# EAGLE design ESP8266-Programmer_2015-11-16 (EAGLE 7.4.0)
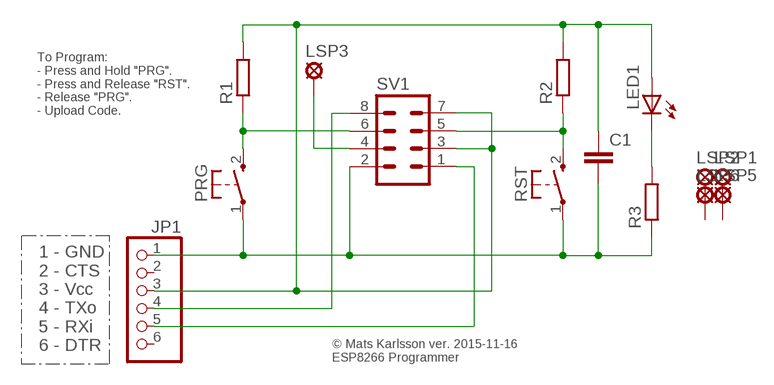
[diagram p0: schematic, sheet 1]

## Parts
C1  C-EU025_050-035X075  [C025_050-035X075]
JP1  PINHD-1X6  [1X06]
LED1  TLLG4400  [LED3MM]
LSP1  SE11  [SE11]
LSP2  SE11  [SE11]
LSP3  SE11  [SE11]
LSP5  SE11  [SE11]
LSP6  SE11  [SE11]
PRG  KSS-2EG4430  [KSS-2EG4430]
R1  R-EU_0204/5  [0204/5]
R2  R-EU_0204/5  [0204/5]
R3  R-EU_0204/7  [0204/7]
RST  KSS-2EG4430  [KSS-2EG4430]
SV1  MA04-2  [MA04-2]

## Nets
N$1: C1.2 JP1.1 PRG.1(P) R3.1 RST.1(P) SV1.2
N$2: R2.1 RST.2(S) SV1.5
N$3: LSP3.MP SV1.4
N$4: JP1.4 SV1.8
N$5: PRG.2(S) R1.1 SV1.6
N$7: C1.1 JP1.3 LED1.A R1.2 R2.2 SV1.3 SV1.7
N$8: JP1.5 SV1.1
N$9: LED1.K(C) R3.2
Unconnected: JP1.2 JP1.6 LSP1.MP LSP2.MP LSP5.MP LSP6.MP

## Notes on the sheet
- To Program:
  - Press and Hold "PRG".
  - Press and Release "RST".
  - Release "PRG".
  - Upload Code.
- 1 - GND
  2 - CTS
  3 - Vcc
  4 - TXo
  5 - RXi
  6 - DTR
- © Mats Karlsson ver. 2015-11-16
  ESP8266 Programmer

## Library data of the parts
C1 = rcl:C-EU: CAPACITOR, European symbol
JP1 = pinhead:PINHD-1X6: PIN HEADER
LED1 = led:TLLG4400: Low Current (2mA) LED 3 mm Tinted Diffused Package color GREEN Source: Data sheet <http://www.farnell.com/datasheets/391098.pdf>; MF: VISHAY SEMICONDUCTOR; OC_FARNELL: 1612435
LSP1-LSP3 LSP5 LSP6 = solpad:SE11: SOLDER PAD RTM, drill 1,1mm, distributor Buerklin, 07F810
PRG RST = buttons:KSS-2EG4430: Size: 3x6mm Height: 5mm from PCB Rating: DC12v 50mA Travel: 0.25±0.10mm Operating Force: 180±50gf Return Force: 60gf min Contact resistance: 100m? max Insulation resistance: 100M? min Operating life?50,000 cycles
R1-R3 = rcl:R-EU_: RESISTOR, European symbol
SV1 = con-lstb:MA04-2: PIN HEADER; OC_FARNELL: unknown; OC_NEWARK: unknown

## Board
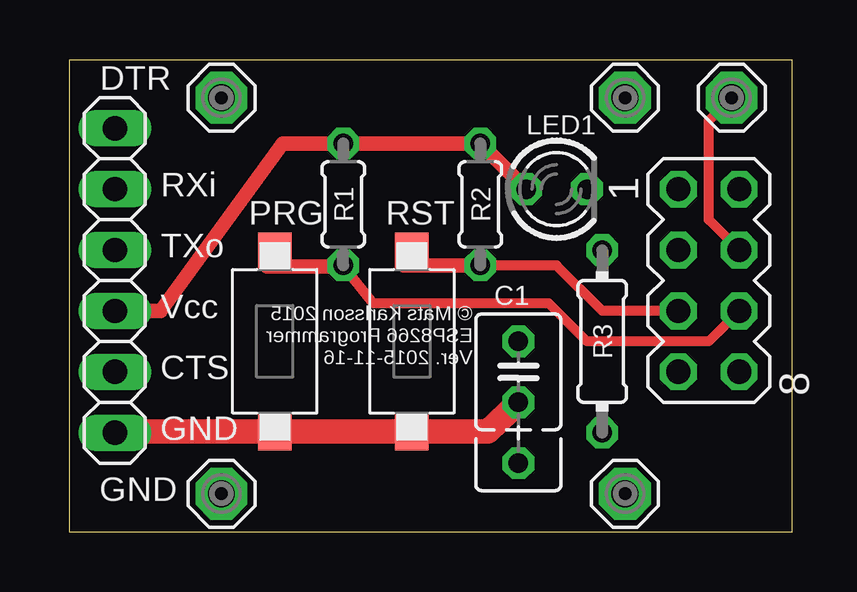
[diagram p1: board, top side]
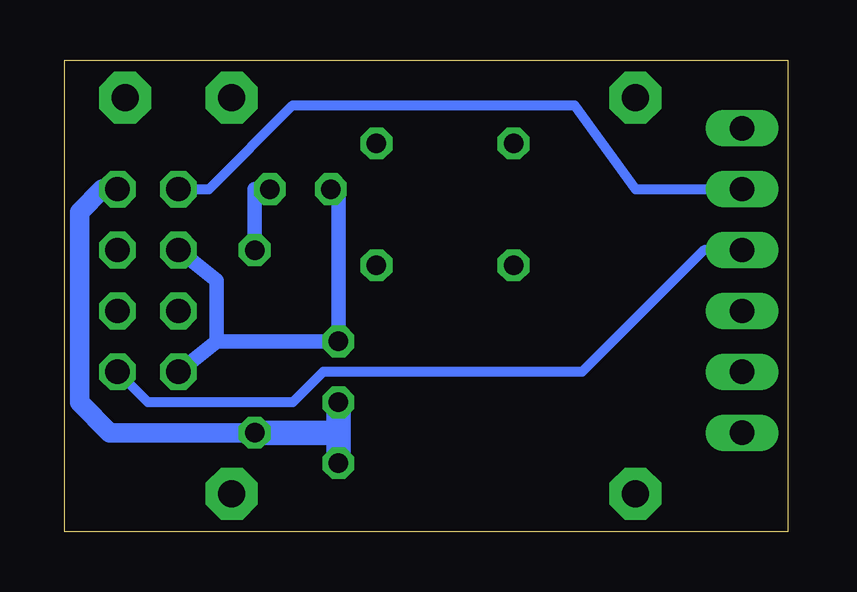
[diagram p2: board, bottom side, seen from below]

Size 30.15 x 19.68 mm. Coordinates in mm from the lower left corner, seen from the top.
Outline: 0,0 30.15,0 30.15,19.68 0,19.68 0,0
Copper layers (1*16): Top 0.035mm / dielectric 1.5mm / Bottom 0.035mm
Design rules "default": minimum track width 10mil, minimum drill 24mil, track to track 8mil, track to pad 8mil, pad to pad 8mil, via to via 8mil, smd to smd 8mil, copper to edge 40mil, drill to drill 8mil, minimum pad ring 10mil, minimum via ring 8mil, stop-mask expansion 4mil, vias tented up to drill 0mil, thermal gap 10mil

### Footprints (pad centres in the part's own frame; a part is rotated, then mirrored left to right if it is on the bottom)
C025_050-035X075 = drill 0.813 octagon: 1 -1.27,0; 2 1.27,0; 3 3.81,0
1X06 = drill 1.016 long: 1 -6.35,0; 2 -3.81,0; 3 -1.27,0; 4 1.27,0; 5 3.81,0; 6 6.35,0
LED3MM = drill 0.813 octagon: A -1.27,0; K 1.27,0
SE11 = drill 1.118 pad 2.159 octagon: MP 0,0
KSS-2EG4430 = smd 1.6 x 1.4: 1 -3.75,0; 2 3.75,0
0204/5 = drill 0.813 octagon: 1 -2.54,0; 2 2.54,0
0204/7 = drill 0.813 octagon: 1 -3.81,0; 2 3.81,0
MA04-2 = drill 1.016 octagon: 1 -3.81,-1.27; 2 -3.81,1.27; 3 -1.27,-1.27; 4 -1.27,1.27; 5 1.27,-1.27; 6 1.27,1.27; 7 3.81,-1.27; 8 3.81,1.27

### Placement (x,y rotation side)
C1  18.73,6.67 270 top
JP1  1.91,10.48 90 top
LED1  20.32,14.29 0 top
LSP1  23.18,18.1 0 top
LSP2  6.35,1.59 0 top
LSP3  27.62,18.1 0 top
LSP5  6.35,18.1 0 top
LSP6  23.18,1.59 0 top
PRG  8.57,7.94 90 top
R1  11.43,13.65 90 top
R2  17.14,13.65 90 top
R3  22.23,7.94 90 top
RST  14.29,7.94 90 top
SV1  26.67,10.48 270 top

### Tracks (layer width: path | path; a pad name or v marks a point on that pad's centre or on a via)
N$1
  Top 0.813: 1.91,4.19 JP1.1
  Top 1.016: C1.2 17.46,4.19 RST.1 PRG.1 1.91,4.19
  Bottom 0.813: R3.1 28.26,4.13 29.53,5.4 29.53,13.34 28.57,14.29 SV1.2
  Bottom 1.016: 18.73,2.86 18.73,4.13 | 18.73,4.13 C1.2 | R3.1 18.73,4.13
N$2
  Top 0.406: SV1.5 22.23,9.21 20.32,11.11 R2.1
  Top 0.61: R2.1 13.97,11.11 RST.2
N$3
  Top 0.406: SV1.4 26.67,13.02 26.67,17.14 LSP3.MP
N$4
  Bottom 0.406: JP1.4 3.49,11.75 8.57,6.67 19.37,6.67 20.64,5.4 26.67,5.4 SV1.8
N$5
  Top 0.406: SV1.6 26.67,7.94 21.59,7.94 20,9.53 12.7,9.53 R1.1 | 8.26,11.05 PRG.2
  Top 0.61: R1.1 11.49,11.05 8.26,11.05
N$7
  Top 0.61: JP1.3 3.81,9.21 8.89,16.19 R1.2 R2.2 LED1.A
  Bottom 0.61: LED1.A 18.73,13.97 C1.1 23.81,7.94 | SV1.7 23.81,7.94 | SV1.3 23.81,10.48 23.81,7.94
N$8
  Bottom 0.406: SV1.1 24.13,14.29 20.64,17.78 8.89,17.78 6.35,14.29 JP1.5
N$9
  Bottom 0.61: R3.2 22.23,14.29 LED1.K

### Text on the board
tPlace: DTR | RXi | TXo | Vcc | © Mats Karlsson 2015 / ESP8266 Programmer / Ver. 2015-11-16 | CTS | GND | GND
tValues: To Program: / - Press and Hold "PRG". / - Press and Release "RST". / - Release "PRG". / - Upload Code.